# EAGLE design protoda7schematic (EAGLE 9.3.2)
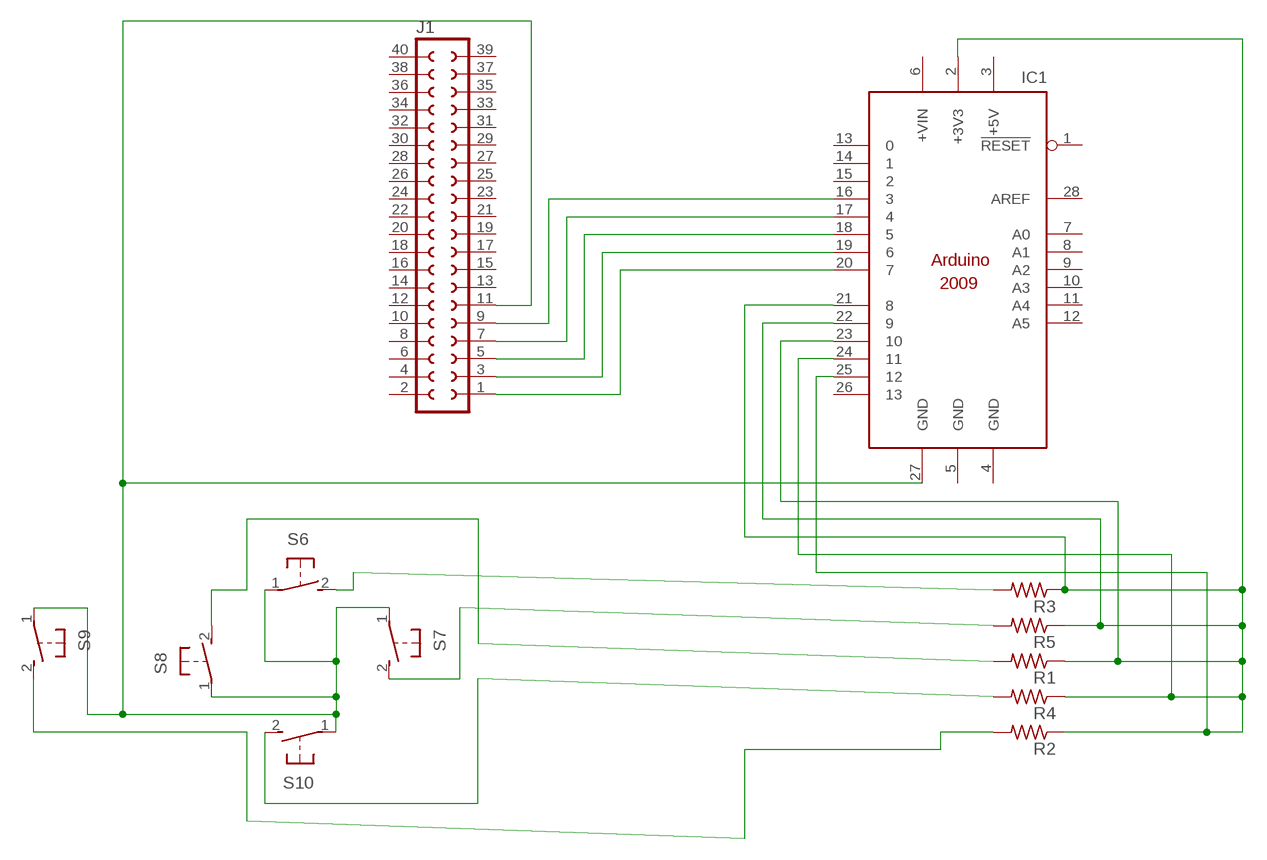
[diagram p0: schematic, sheet 1]

## Parts
IC1  ARDUINO2009_10  [ARDUINO2009]
J1  SOCKET-40V  [S40V]
R1  R-US_0204/5  [0204/5]
R2  R-US_0204/5  [0204/5]
R3  R-US_0204/5  [0204/5]
R4  R-US_0204/5  [0204/5]
R5  R-US_0204/5  [0204/5]
S6  31-XX  [B3F-31XX]
S7  31-XX  [B3F-31XX]
S8  31-XX  [B3F-31XX]
S9  31-XX  [B3F-31XX]
S10  31-XX  [B3F-31XX]

## Nets
N$1: IC1.20 J1.1
N$2: IC1.19 J1.3
N$3: IC1.18 J1.5
N$4: IC1.17 J1.7
N$5: IC1.16 J1.9
N$6: IC1.2(+3V3) IC1.21 IC1.22 IC1.23 IC1.24 IC1.25 R1.1 R2.1 R3.1 R4.1 R5.1
N$7: R3.2 S6.2(S)
N$8: R5.2 S7.2(S)
N$9: IC1.27(GND) J1.11 S6.1(P) S7.1(P) S8.1(P) S9.1(P) S10.1(P)
N$10: R4.2 S10.2(S)
N$11: R1.2 S8.2(S)
N$12: R2.2 S9.2(S)
Unconnected: IC1.1(!RESET) IC1.6(+VIN) IC1.7(A0) IC1.8(A1) IC1.9(A2) IC1.10(A3) IC1.11(A4) IC1.12(A5) IC1.13 IC1.14 IC1.15 IC1.26 IC1.28(AREF) J1.2 J1.4 J1.6 J1.8 J1.10 J1.12 J1.13 J1.14 J1.15 J1.16 J1.17 J1.18 J1.19 J1.20 J1.21 J1.22 J1.23 J1.24 J1.25 J1.26 J1.27 J1.28 J1.29 J1.30 J1.31 J1.32 J1.33 J1.34 J1.35 J1.36 J1.37 J1.38 J1.39 J1.40

## Power pins joined to a net without a drawn wire
+5V: IC1.3(+5V)
GND: IC1.4(GND) IC1.5(GND)

## Library data of the parts
IC1 = arduino:ARDUINO2009_1: The Arduino Duemilanove ("2009") is a microcontroller board based on the ATmega168 or ATmega328. - 14 digital input/output pins (of which 6 can be used as PWM outputs) - 6 analog inputs, a 16 MHz crystal oscillator - USB connection - power jack - ISP header - reset button It contains everything needed to support the microcontroller; simply connect it to a computer with a USB cable or power it with a AC-to-DC adapter or battery to get started http://arduino.cc/en/Main/ArduinoBoardDuemilanove
J1 = con-3m-skt-header:SOCKET-40: 40 pin PCB Socket (3m 85xx/51xx)
R1-R5 = rcl:R-US_: RESISTOR, American symbol; SPICEPREFIX: R
S6-S10 = switch-omron:31-XX: OMRON SWITCH; MPN: B3F-3100; OC_FARNELL: 959704; OC_NEWARK: 36M3582

## Board
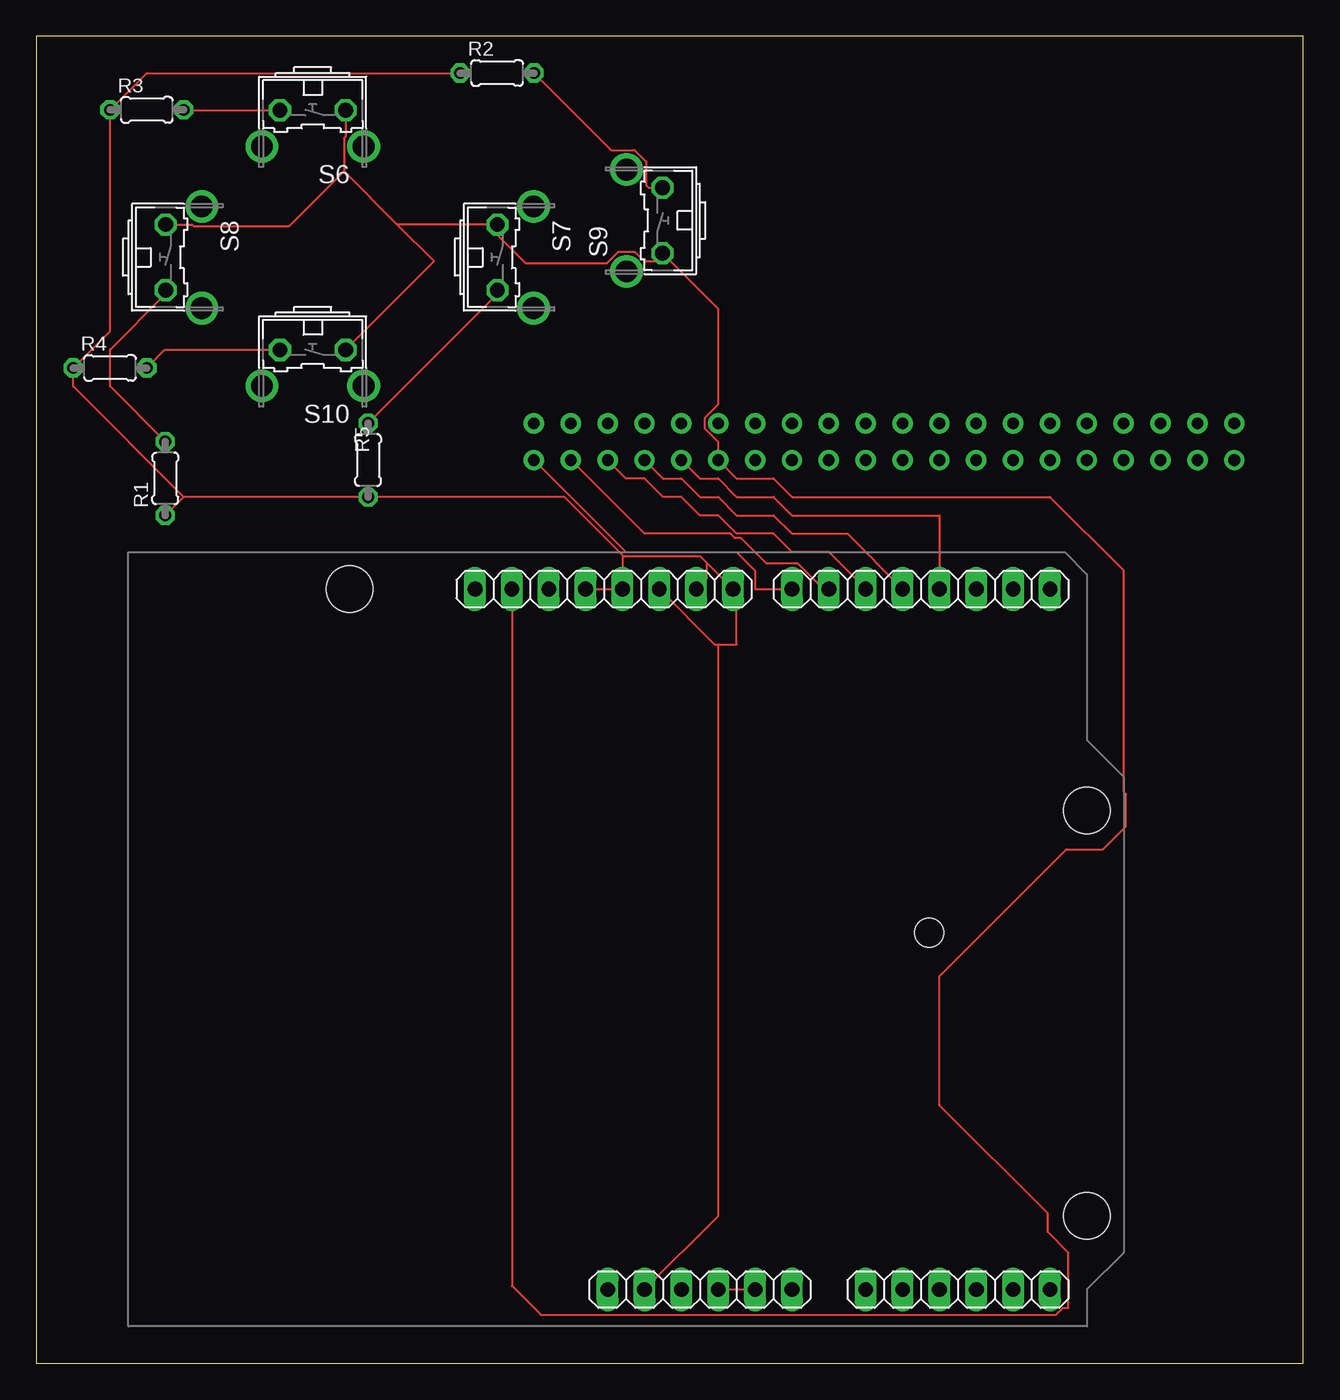
[diagram p1: board, top side]
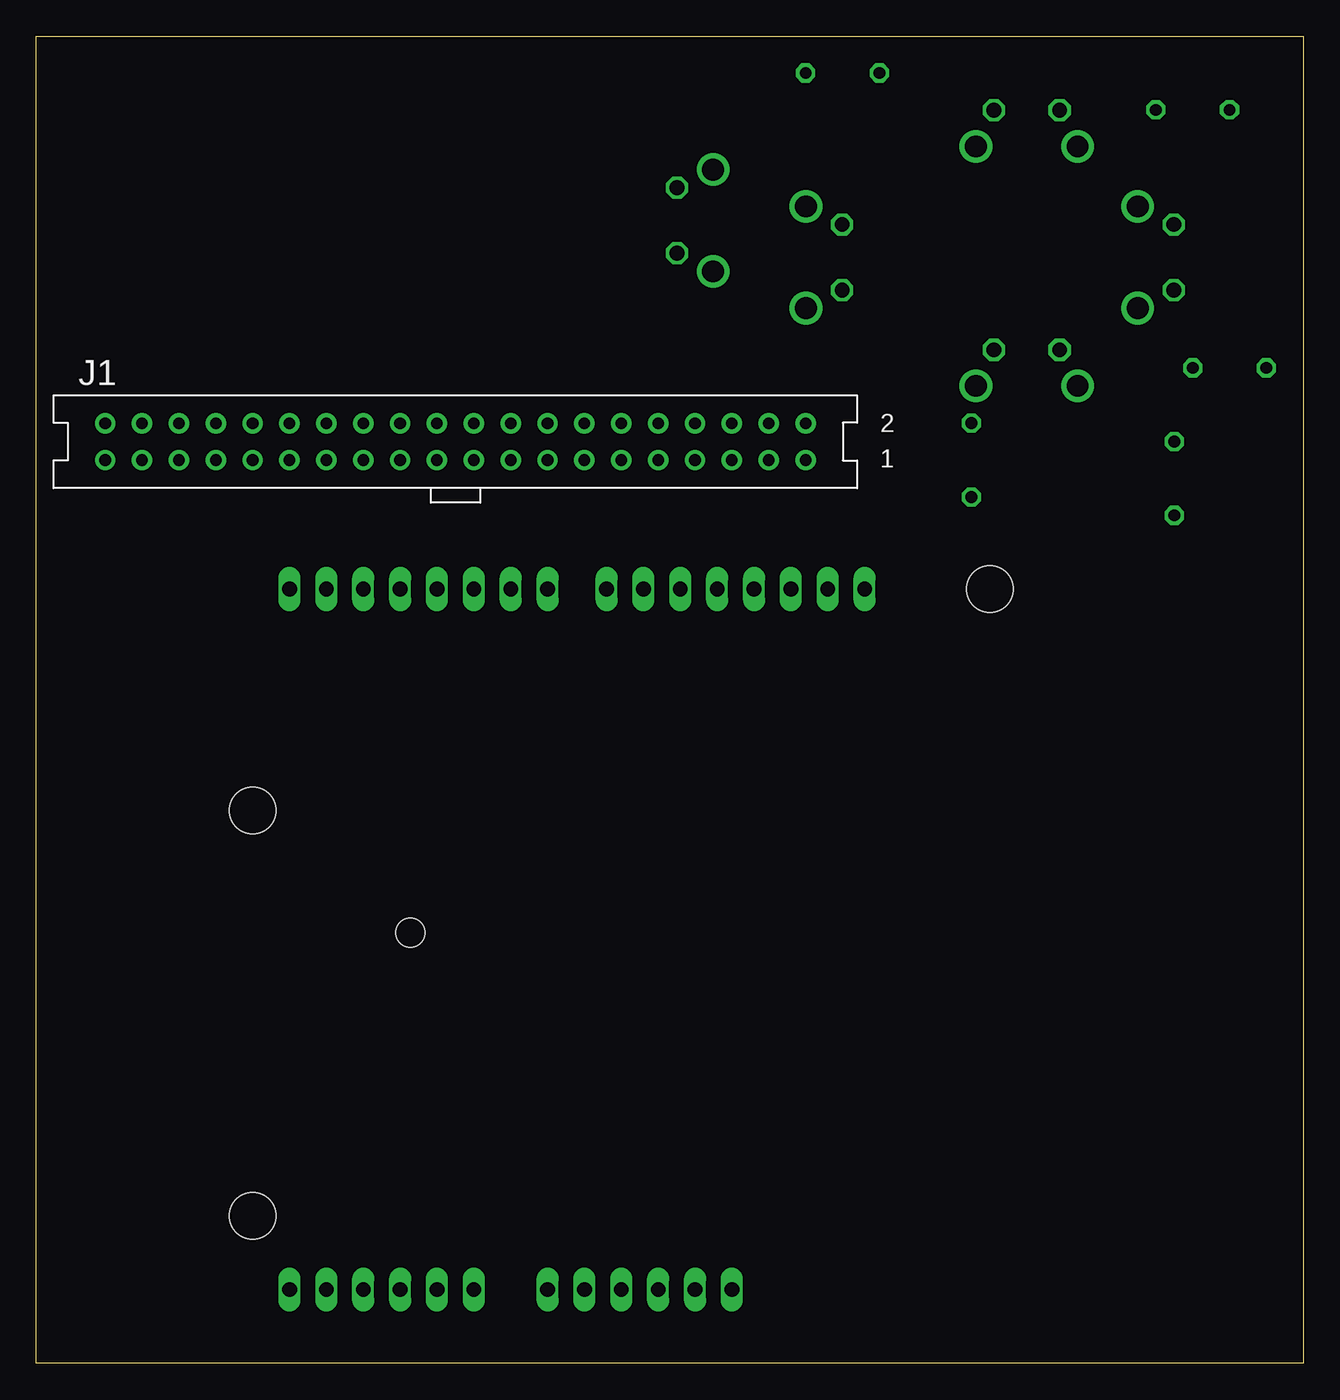
[diagram p2: board, bottom side, seen from below]

Size 87.3 x 91.43 mm. Coordinates in mm from the lower left corner, seen from the top.
Outline: 0,0 87.3,0 87.3,91.43 0,91.43 0,0
Copper layers (1*16): Top 0.035mm / dielectric 1.5mm / Bottom 0.035mm
Design rules "default": minimum track width 6mil, minimum drill 0.35mm, track to track 6mil, track to pad 6mil, pad to pad 6mil, via to via 6mil, smd to smd 6mil, copper to edge 40mil, drill to drill 6mil, minimum pad ring 10mil, minimum via ring 8mil, stop-mask expansion 4mil, vias tented up to drill 0mil, thermal gap 10mil

### Footprints (pad centres in the part's own frame; a part is rotated, then mirrored left to right if it is on the bottom)
ARDUINO2009 = drill 1.016 long: 1 33.02,2.54; 2 35.56,2.54; 3 38.1,2.54; 4 40.64,2.54; 5 43.18,2.54; 6 45.72,2.54; 7 50.8,2.54; 8 53.34,2.54; 9 55.88,2.54; 10 58.42,2.54; 11 60.96,2.54; 12 63.5,2.54; 13 63.5,50.8; 14 60.96,50.8; 15 58.42,50.8; 16 55.88,50.8; 17 53.34,50.8; 18 50.8,50.8; 19 48.26,50.8; 20 45.72,50.8; 21 41.656,50.8; 22 39.116,50.8; 23 36.576,50.8; 24 34.036,50.8; 25 31.496,50.8; 26 28.956,50.8; 27 26.416,50.8; 28 23.876,50.8 | hole 3.2: 15.24,50.8; 66.04,35.56; 66.04,7.62 | hole 2: 55.17,27.114
S40V = drill 0.8 pad 1.4: 1 24.13,-1.27; 2 24.13,1.27; 3 21.59,-1.27; 4 21.59,1.27; 5 19.05,-1.27; 6 19.05,1.27; 7 16.51,-1.27; 8 16.51,1.27; 9 13.97,-1.27; 10 13.97,1.27; 11 11.43,-1.27; 12 11.43,1.27; 13 8.89,-1.27; 14 8.89,1.27; 15 6.35,-1.27; 16 6.35,1.27; 17 3.81,-1.27; 18 3.81,1.27; 19 1.27,-1.27; 20 1.27,1.27; 21 -1.27,-1.27; 22 -1.27,1.27; 23 -3.81,-1.27; 24 -3.81,1.27; 25 -6.35,-1.27; 26 -6.35,1.27; 27 -8.89,-1.27; 28 -8.89,1.27; 29 -11.43,-1.27; 30 -11.43,1.27; 31 -13.97,-1.27; 32 -13.97,1.27; 33 -16.51,-1.27; 34 -16.51,1.27; 35 -19.05,-1.27; 36 -19.05,1.27; 37 -21.59,-1.27; 38 -21.59,1.27; 39 -24.13,-1.27; 40 -24.13,1.27
0204/5 = drill 0.813 octagon: 1 -2.54,0; 2 2.54,0
B3F-31XX = drill 1.016 octagon: 1 -2.261,-1.245; 2 2.261,-1.245 | drill 1.499 pad 2.159: 3 -3.505,1.245; 4 3.505,1.245

### Placement (x,y rotation side)
IC1  6.35,2.54 0 top
J1  58.42,63.5 0 bottom
R1  8.89,60.96 90 top
R2  31.75,88.9 0 top
R3  7.62,86.36 0 top
R4  5.08,68.58 0 top
R5  22.86,62.23 90 top
S6  19.05,85.09 180 top
S7  33.02,76.2 270 top
S8  10.16,76.2 270 top
S9  41.91,78.74 90 top
S10  19.05,68.58 180 top

### Tracks (layer width: path | path; a pad name or v marks a point on that pad's centre or on a via)
GND
  Top 0.152: IC1.4 IC1.5
N$1
  Top 0.152: J1.1 40.64,55.88 48.26,55.88 49.53,54.61 49.53,53.34 IC1.20
N$2
  Top 0.152: IC1.19 54.23,53.34 52.48,55.09 50.32,55.09 48.56,56.84 48.13,56.84 47.83,57.15 41.91,57.15 J1.3
N$3
  Top 0.152: IC1.18 54.61,55.88 52.07,55.88 50.8,57.15 48.26,57.15 46.99,58.42 45.72,58.42 44.45,59.69 43.18,59.69 41.91,60.96 40.64,60.96 J1.5
N$4
  Top 0.152: J1.7 43.18,60.96 44.45,60.96 45.72,59.69 46.99,59.69 48.26,58.42 50.8,58.42 52.07,57.15 55.88,57.15 IC1.17
N$5
  Top 0.152: J1.9 45.72,60.96 46.99,60.96 48.26,59.69 50.8,59.69 52.07,58.42 62.23,58.42 IC1.16
N$6
  Top 0.152: 46.23,55.12 IC1.21 48.26,53.09 48.26,49.53 46.99,49.53 | 46.23,55.12 45.77,55.57 40.51,55.57 40.42,55.66 | 40.42,55.66 36.4,59.69 R5.1 10.16,59.69 | 10.16,59.69 R1.1 | 10.16,59.69 2.54,67.31 R4.1 5.08,71.12 R3.1 7.62,88.9 R2.1 | IC1.23 46.74,49.53 46.99,49.53 | IC1.22 46.23,54.1 46.23,55.12 | IC1.2 46.99,10.16 46.99,49.53 | IC1.25 IC1.24 40.42,53.38 40.42,55.66
N$7
  Top 0.152: R3.2 10.19,86.34 S6.2
N$8
  Top 0.152: R5.2 31.77,73.69 S7.2
N$9
  Top 0.152: IC1.27 32.77,5.33 34.77,3.33 70.26,3.33 70.74,3.81 71.12,3.81 71.12,7.62 69.7,9.04 69.7,10.31 62.23,17.78 62.23,26.67 70.97,35.41 73.51,35.41 75.08,36.98 75.08,39.21 74.93,39.37 74.93,54.61 69.85,59.69 52.07,59.69 50.8,60.96 48.26,60.96 J1.11 46.99,63.46 46.06,64.39 46.06,65.16 46.99,66.08 46.99,72.64 43.31,76.33 | 43.31,76.33 S9.1 | 43.31,76.33 42.9,75.92 41.89,75.92 41.23,76.59 40.1,76.59 39.33,75.81 33.7,75.81 31.77,77.74 S7.1 24.87,78.46 | S10.1 27.41,75.92 24.87,78.46 | S6.1 21.31,84.51 21.2,84.41 21.2,82.12 | 21.2,82.12 24.87,78.46 | S8.1 10.74,78.46 10.84,78.35 17.43,78.35 21.2,82.12
N$10
  Top 0.152: R4.2 8.87,69.83 S10.2
N$11
  Top 0.152: R1.2 5.08,67.31 5.08,69.85 8.92,73.69 S8.2
N$12
  Top 0.152: S9.2 42.19,81 42.02,81.17 42.02,82.81 41.23,83.6 39.59,83.6 R2.2